# Altium schematic sheet Hardware_Architecture.SchDoc: Evaluation Board 3.2
size A3; Organization: Toradex AG; Address1: Altsagenstrasse 5; Address2: Horw; Address3: 6048; Address4: Switzerland; DocumentNumber: 2; Revision: V3.2; SheetNumber: 2; SheetTotal: 23; PageSetup: Record=PageOptions|CenterHorizontal=True|CenterVertical=True|PrintScale=0.73|XCorrection=1.00|YCorrection=1.00|PrintKind=0|BorderSize=5000000|LeftOffset=0|BottomOffset=0|Orientation=2|PaperLength=1000|PaperWidth=1000|Scale=100|PaperSource=7|PrintQuality=600|MediaType=1|DitherType=10|PaperKind=A4|PrintScaleMode=1
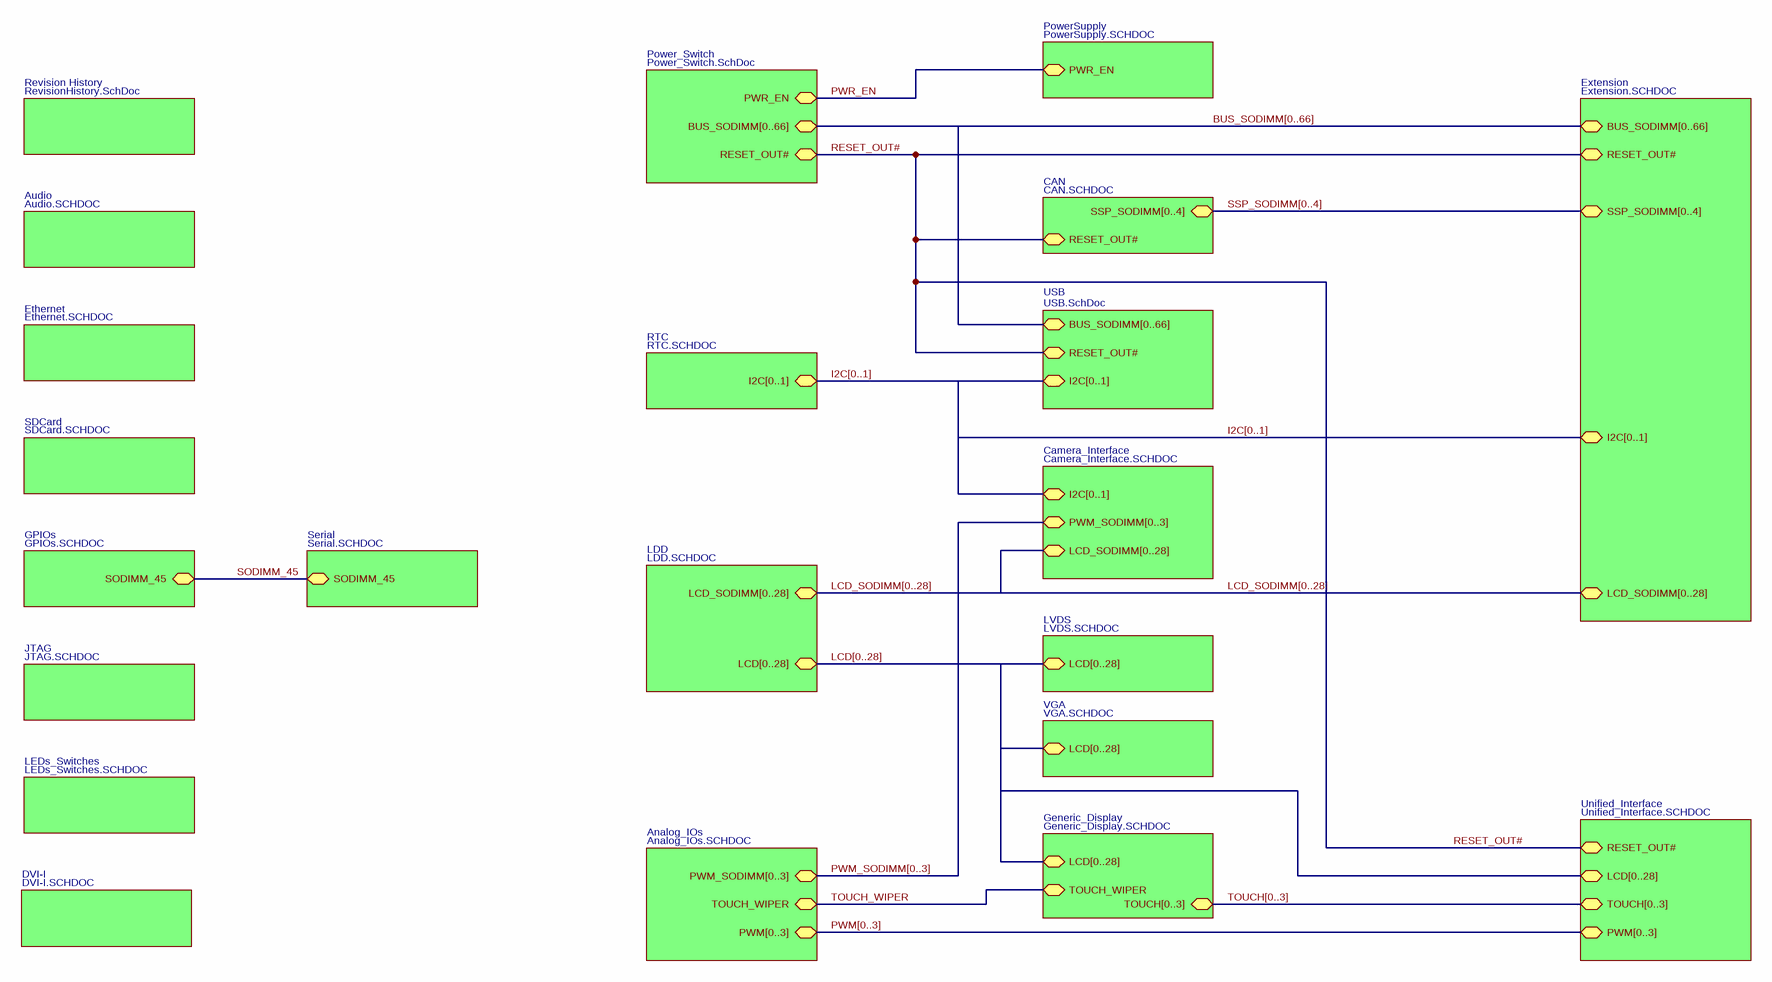
[diagram p0: Hardware_Architecture.SchDoc]

## Sub-sheets
Analog_IOs = Analog_IOs.SCHDOC: TOUCH_WIPER (bidir), PWM_SODIMM[0..3] (bidir), PWM[0..3] (bidir)
Audio = Audio.SCHDOC: no entries
Camera_Interface = Camera_Interface.SCHDOC: I2C[0..1] (bidir), PWM_SODIMM[0..3] (bidir), LCD_SODIMM[0..28] (bidir)
CAN = CAN.SCHDOC: RESET_OUT# (bidir), SSP_SODIMM[0..4] (bidir)
DVI-I = DVI-I.SCHDOC: no entries
Ethernet = Ethernet.SCHDOC: no entries
Extension = Extension.SCHDOC: I2C[0..1] (bidir), SSP_SODIMM[0..4] (bidir), RESET_OUT# (bidir), LCD_SODIMM[0..28] (bidir), BUS_SODIMM[0..66] (bidir)
Generic_Display = Generic_Display.SCHDOC: LCD[0..28] (bidir), TOUCH_WIPER (bidir), TOUCH[0..3] (bidir)
GPIOs = GPIOs.SCHDOC: SODIMM_45 (bidir)
JTAG = JTAG.SCHDOC: no entries
LDD = LDD.SCHDOC: LCD[0..28] (bidir), LCD_SODIMM[0..28] (bidir)
LEDs_Switches = LEDs_Switches.SCHDOC: no entries
LVDS = LVDS.SCHDOC: LCD[0..28] (bidir)
Power_Switch = Power_Switch.SchDoc: RESET_OUT# (bidir), PWR_EN (bidir), BUS_SODIMM[0..66] (bidir)
PowerSupply = PowerSupply.SCHDOC: PWR_EN (bidir)
Revision History = RevisionHistory.SchDoc: no entries
RTC = RTC.SCHDOC: I2C[0..1] (bidir)
SDCard = SDCard.SCHDOC: no entries
Serial = Serial.SCHDOC: SODIMM_45 (bidir)
Unified_Interface = Unified_Interface.SCHDOC: LCD[0..28] (bidir), TOUCH[0..3] (bidir), PWM[0..3] (bidir), RESET_OUT# (bidir)
USB = USB.SchDoc: RESET_OUT# (bidir), I2C[0..1] (bidir), BUS_SODIMM[0..66] (bidir)
VGA = VGA.SCHDOC: LCD[0..28] (bidir)

## Nets
PWR_EN: sheet PowerSupply/PWR_EN, sheet Power_Switch/PWR_EN
RESET_OUT#: sheet Extension/RESET_OUT#, sheet USB/RESET_OUT#, sheet Power_Switch/RESET_OUT#, sheet CAN/RESET_OUT#, sheet Unified_Interface/RESET_OUT#
SODIMM_45: sheet Serial/SODIMM_45, sheet GPIOs/SODIMM_45
TOUCH_WIPER: sheet Generic_Display/TOUCH_WIPER, sheet Analog_IOs/TOUCH_WIPER

## Buses and harness runs
bus BUS_SODIMM[0..66] = sheet Extension/BUS_SODIMM[0..66] = sheet Power_Switch/BUS_SODIMM[0..66] = sheet USB/BUS_SODIMM[0..66]
bus I2C[0..1] = sheet Camera_Interface/I2C[0..1] = sheet Extension/I2C[0..1] = sheet RTC/I2C[0..1] = sheet USB/I2C[0..1]
bus LCD[0..28] = sheet Generic_Display/LCD[0..28] = sheet LDD/LCD[0..28] = sheet LVDS/LCD[0..28] = sheet Unified_Interface/LCD[0..28] = sheet VGA/LCD[0..28]
bus LCD_SODIMM[0..28] = sheet Camera_Interface/LCD_SODIMM[0..28] = sheet Extension/LCD_SODIMM[0..28] = sheet LDD/LCD_SODIMM[0..28]
bus PWM[0..3] = sheet Analog_IOs/PWM[0..3] = sheet Unified_Interface/PWM[0..3]
bus PWM_SODIMM[0..3] = sheet Analog_IOs/PWM_SODIMM[0..3] = sheet Camera_Interface/PWM_SODIMM[0..3]
bus SSP_SODIMM[0..4] = sheet CAN/SSP_SODIMM[0..4] = sheet Extension/SSP_SODIMM[0..4]
bus TOUCH[0..3] = sheet Generic_Display/TOUCH[0..3] = sheet Unified_Interface/TOUCH[0..3]

## Notes on the sheet
- Title
- Size:
- Date:
- A3
- Number:
- Time:
- Revision:
- Sheet
- of
- File: